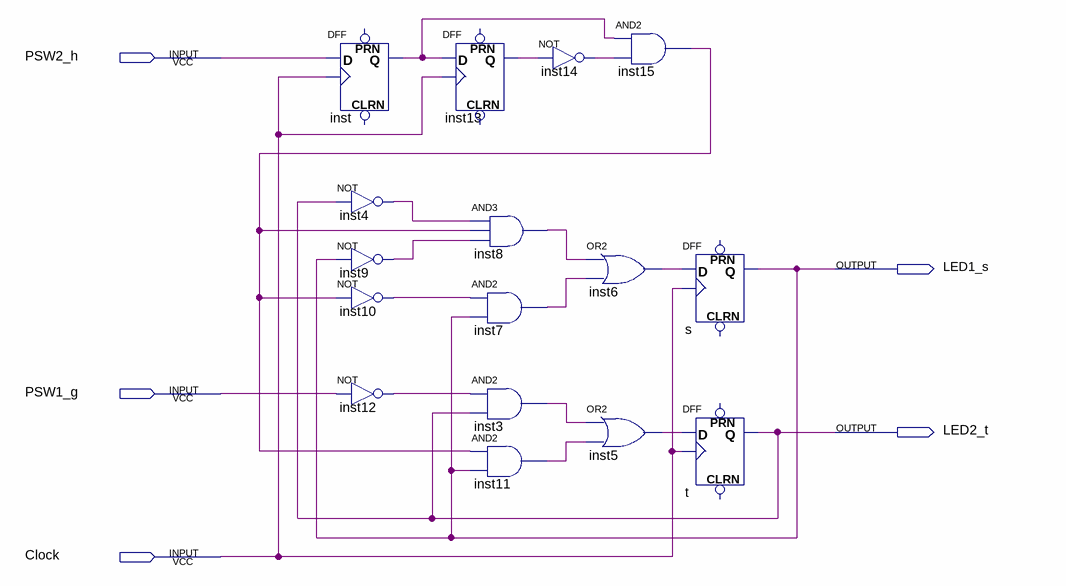
[diagram p0: schematic sheet]
// Quartus schematic q4.bdf as structural Verilog: 16 symbols, 5 pins
module q4 (
  input  PSW2_h,
  input  PSW1_g,
  input  Clock,
  output LED1_s,
  output LED2_t
);

  wire inst3_out, inst4_out, inst5_out, inst6_out, inst7_out, inst8_out, inst9_out, inst10_out, inst11_out,
       inst12_out, inst13_q, inst14_out, inst15_out, inst_q;

  DFF inst (.CLK(Clock), .D(PSW2_h), .Q(inst_q));  // open: CLRN, PRN
  not inst4 (inst4_out, LED2_t);
  not inst9 (inst9_out, LED1_s);
  not inst10 (inst10_out, inst15_out);
  not inst12 (inst12_out, PSW1_g);
  DFF inst13 (.CLK(Clock), .D(inst_q), .Q(inst13_q));  // open: CLRN, PRN
  not inst14 (inst14_out, inst13_q);
  and inst8 (inst8_out, inst4_out, inst15_out, inst9_out);
  and inst7 (inst7_out, inst10_out, LED1_s);
  and inst3 (inst3_out, inst12_out, LED2_t);
  and inst11 (inst11_out, inst15_out, LED1_s);
  and inst15 (inst15_out, inst_q, inst14_out);
  or inst6 (inst6_out, inst8_out, inst7_out);
  or inst5 (inst5_out, inst3_out, inst11_out);
  DFF s (.CLK(Clock), .D(inst6_out), .Q(LED1_s));  // open: CLRN, PRN
  DFF t (.CLK(Clock), .D(inst5_out), .Q(LED2_t));  // open: CLRN, PRN
endmodule
